# EasyEDA Pro project Servo_Power_Board.epro

# Schematic Schematic1
Board Name: Board1; Create Date: 2026-04-25; Page Name: P1; Project Name: Servo_Board; Schematic Name: Schematic1; Update Date: 2026-05-03; Company: EasyEDA.com; Page Size: A4; Version: V1.0
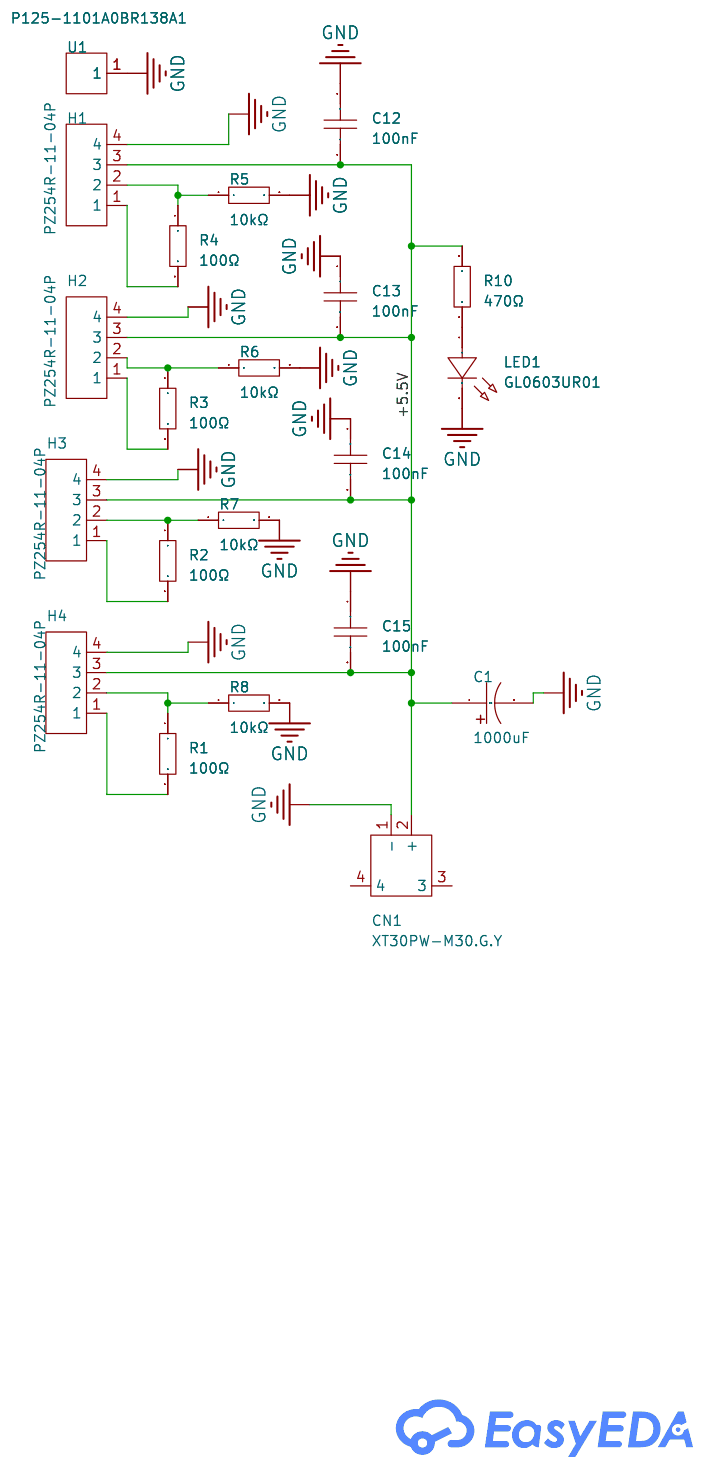
[diagram p0: schematic sheet]

## Parts
C1  1000uF  [CAP-SMD_BD10.0-L10.3-W10.3-LS11.0-R-RD]
C12  100nF  [C0603]
C13  100nF  [C0603]
C14  100nF  [C0603]
C15  100nF  [C0603]
CN1  XT30PW-M30.G.Y  [CONN-TH_XT30PW-M]
H1  PZ254R-11-04P  [HDR-TH_4P-P2.54-H-M-W10.4]
H2  PZ254R-11-04P  [HDR-TH_4P-P2.54-H-M-W10.4]
H3  PZ254R-11-04P  [HDR-TH_4P-P2.54-H-M-W10.4]
H4  PZ254R-11-04P  [HDR-TH_4P-P2.54-H-M-W10.4]
LED1  GL0603UR01  [LED0603-FD]
R1  100Ω  [R0603]
R2  100Ω  [R0603]
R3  100Ω  [R0603]
R4  100Ω  [R0603]
R5  10kΩ  [R0603]
R6  10kΩ  [R0603]
R7  10kΩ  [R0603]
R8  10kΩ  [R0603]
R10  470Ω  [R0603]
U1  P125-1101A0BR138A1  [HDR-TH_1P-P2.54-H-M-W9.7-N]

## Library data of the parts
C1 = VZH102M1ATR-1010: Capacitance:1000uF Tolerance:±20% Tolerance:±20% Voltage Rating:10V Ripple Current:- Equivalent Series Resistance(ESR):- Diameter:10mm Height - Seated (Max):10mm Lifetime:5000hrs@105℃ Operating Temperature:-45℃~+105℃ Operating Temperature:-45℃~+105℃; LCSC Part Name: 1000uF ±20% 10V; Supplier Part: C176684; Manufacturer: Lelon(立隆); Supplier Footprint: SMD,D10xL10mm; JLCPCB Part Class: Extended Part; Datasheet: https://item.szlcsc.com/datasheet/VZH102M1ATR-1010/188074.html; Supplier: LCSC; Tolerance: ±20%; Voltage Rating: 10V; Diameter: 10mm; Height - Seated (Max): 10mm; Lifetime: 5000hrs@105℃; Operating Temperature: -45℃~+105℃
C12-C15 = CAP_0603: Supplier Footprint: 0603
CN1 = XT30PW-M30.G.Y: Rated current:15A Rated voltage: Connector type:Model aircraft plug Wire gauge: contact resistance: Size/Specification: interface form:Male; LCSC Part Name: AMASS(艾迈斯)航模插头电调机插座锂电池连接器 PCB板卧式 公头XT30PW-M30.G.Y; Supplier Part: C431092; Manufacturer: AMASS(艾迈斯); JLCPCB Part Class: Extended Part; Datasheet: https://item.szlcsc.com/datasheet/XT30PW-M30.G.Y/426930.html; Supplier: LCSC; Rated current: 15A; Connector type: Model aircraft plug; interface form: Male
H1-H4 = PZ254R-11-04P: Pin Structure:1x4P Pitch:2.54mm Row Spacing:- Circluar Pins/Square Pins:Pin Header Mounting Type:Right Angle Number of Rows:1 Number of Pins:4P Current Rating:3A Voltage Rating (Max):250V Length of Mating Pin:6mm Insulation Height:2.5mm Length of End Conn; LCSC Part Name: 1x4P 间距:2.54mm 方针 弯插; Supplier Part: C492412; Manufacturer: XFCN(兴飞); Supplier Footprint: 弯插,P=2.54mm; JLCPCB Part Class: Extended Part; Datasheet: https://item.szlcsc.com/datasheet/PZ254R-11-04P/502968.html; Supplier: LCSC; Pin Structure: 1x4P; Pitch: 2.54mm; Circluar Pins/Square Pins: Pin Header; Mounting Type: Right Angle; Number of Rows: 1; Number of Pins: 4P; Current Rating: 3A; Voltage Rating (Max): 250V; Length of Mating Pin: 6mm; Insulation Height: 2.5mm; Contact Material: Brass; Operating Temperature: -40℃~+105℃; Color: Black
LED1 = GL0603UR01: Illumination Color:Red Voltage - Forward(Vf):2.4V Voltage - Forward(Vf):2.4V Forward Current:20mA Wavelength - Dominant:620nm~625nm Wavelength - Dominant:620nm~625nm Diode Configuration:Discrete Diode Lens Color:Water Clear Luminous Intensity:120mcd Lumin; LCSC Part Name: 0603 红灯 高亮; Supplier Part: C51933292; Manufacturer: Guiguang light(桂光光电); Supplier Footprint: 0603; JLCPCB Part Class: Extended Part; Datasheet: https://item.szlcsc.com/datasheet/GL0603UR01/54645988.html; Supplier: LCSC; Illumination Color: Red; Voltage - Forward(Vf): 2.4V; Forward Current: 20mA; Wavelength - Dominant: 620nm~625nm; Diode Configuration: Discrete Diode; Lens Color: Water Clear; Luminous Intensity: 120mcd; Viewing Angle: 120°; Mounting Style: Top-mount; Operating Temperature: -40℃~+85℃
R1-R8 R10 = Res_0603: Supplier Footprint: 0603
U1 = P125-1101A0BR138A1: Pin Structure:1x1P Pitch:2.54mm Row Spacing:2.54mm Circluar Pins/Square Pins:Policy Mounting Type:Right-Angle Number of Rows:Single Row Number of Pins:1P Current Rating:- Voltage Rating (Max):- Length of Mating Pin:6mm Insulation Height:2.5mm Length of En; LCSC Part Name: 1x1P 间距:2.54mm 方针 弯插; Supplier Part: C19190474; Manufacturer: Yxcon(宇熙精密); Supplier Footprint: 弯插,P=2.54mm; JLCPCB Part Class: Extended Part; Datasheet: https://atta.szlcsc.com/upload/public/pdf/source/20231110/B4ABAE5F26C4676492BFDA946B0BE3CA.pdf; Supplier: LCSC; Pin Structure: 1x1P; Pitch: 2.54mm; Row Spacing: 2.54mm; Circluar Pins/Square Pins: Policy; Mounting Type: Right-Angle; Number of Rows: Single Row; Number of Pins: 1P; Length of Mating Pin: 6mm; Insulation Height: 2.5mm; Contact Material: Brass; Contact Plating: Gold; Operating Temperature: -40℃~+105℃; Color: Black

## Nets
+5.5V: C1.1 C12.2 C13.2 C14.2 C15.2 CN1.2(+) H1.3 H2.3 H3.3 H4.3 R10.2
GND: C1.2 C12.1 C13.1 C14.1 C15.1 CN1.1(-) H1.4 H2.4 H3.4 H4.4 LED1.2(C) R5.2 R6.2 R7.2 R8.2 U1.1
$1N327: H3.2 R2.1 R7.1
$1N900: H4.1 R1.2
$1N942: H3.1 R2.2
$1N974: H2.2 R3.1 R6.1
$1N976: H2.1 R3.2
$1N1755: H4.2 R1.1 R8.1
$1N1955: H1.1 R4.2
$1N1961: H1.2 R4.1 R5.1
Net-(LED1-1): LED1.1(A) R10.1

Not connected (* = marked no-connect by the designer): CN1 3 4

# Board PCB1
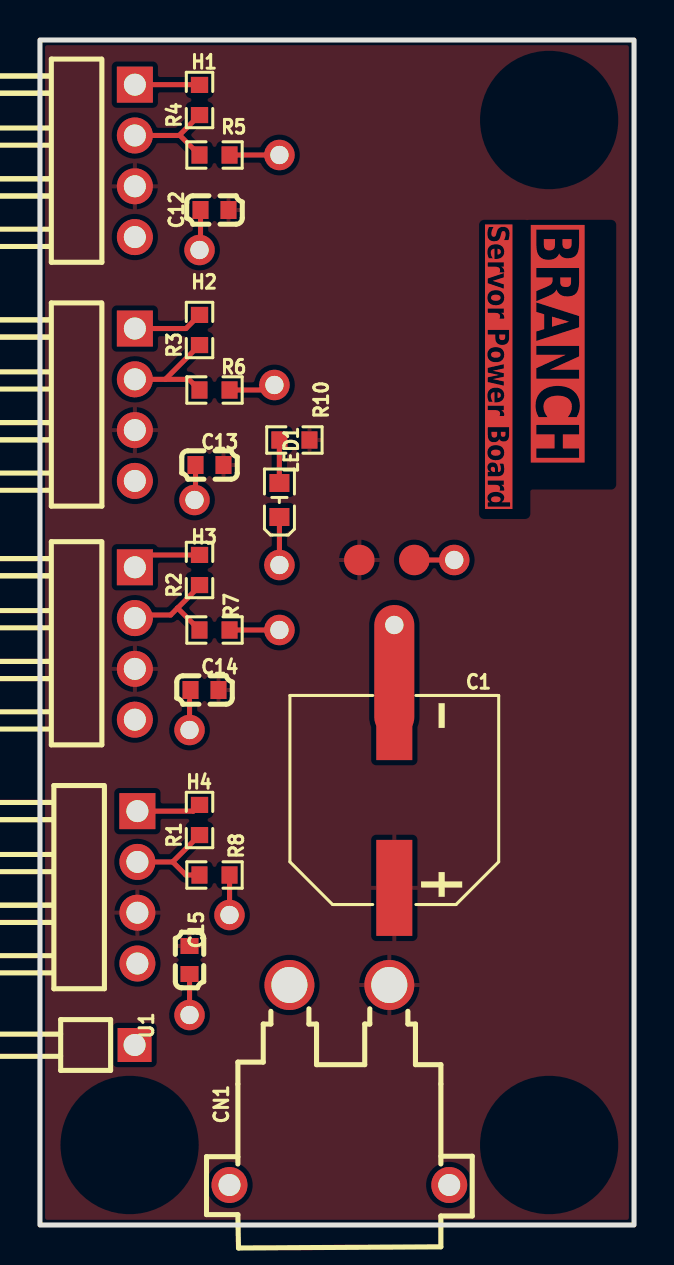
[diagram p1: board, top side]
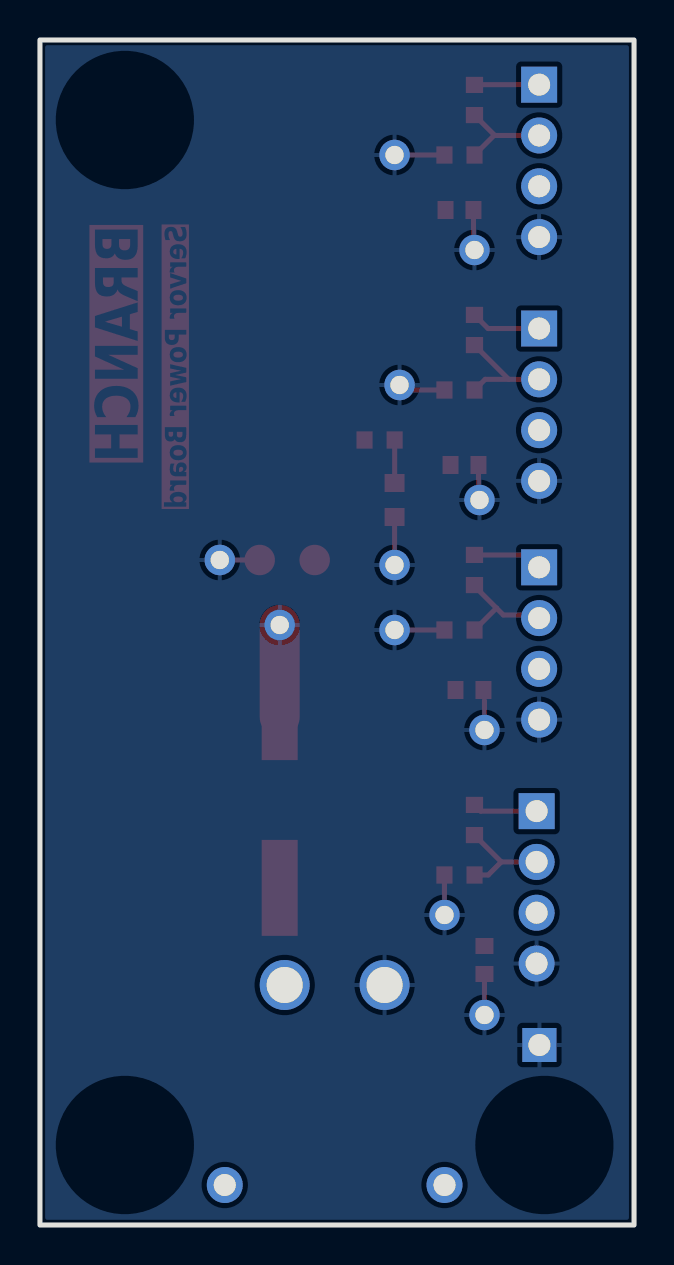
[diagram p2: board, bottom side, seen from below]

Outline 29.74 x 59.25 mm; copper layers: Top Layer, Bottom Layer. Coordinates in mm from the lower left corner of the outline.
Outline path: rectangle 0,59.25 29.74,0
Stack: Top Layer 0.035mm / Dielectric1 1.51mm FR4 er 4.5 / Bottom Layer 0.035mm

## Design rules (mm)
template: Custom Config
spacing copperThickness1oz (default): track to track 0.102, other pairs 0.152 to 0.3
spacing copperThickness2oz: track to track 0.203, other pairs 0.152 to 0.3
track width copperThickness1oz (default): min 0.127, default 0.254, max 5
track width copperThickness2oz: min 0.203, default 0.254, max 2.54
differential pair differentialPair (default): width min 0.127, default 0.254, max 2.54; gap min 0.152, default 0.152
via viaSize (default): diameter min 0.5, default 0.61, max 10; hole min 0.3, default 0.305, max 6.3

## Placement (name value [footprint] x y rotation side)
C1  1000uF  [CAP-SMD_BD10.0-L10.3-W10.3-LS11.0-R-RD]  17.74 21.25 270 top
C12  100nF  [C0603]  8.74 50.75 0 top
C13  100nF  [C0603]  8.49 38 0 top
C14  100nF  [C0603]  8.24 26.75 0 top
C15  100nF  [C0603]  7.49 13.25 90 top
CN1  XT30PW-M30.G.Y  [CONN-TH_XT30PW-M]  14.99 7 0 top
H1  PZ254R-11-04P  [HDR-TH_4P-P2.54-H-M-W10.4]  4.75 53.21 270 top
H2  PZ254R-11-04P  [HDR-TH_4P-P2.54-H-M-W10.4]  4.75 41.01 270 top
H3  PZ254R-11-04P  [HDR-TH_4P-P2.54-H-M-W10.4]  4.75 29.08 270 top
H4  PZ254R-11-04P  [HDR-TH_4P-P2.54-H-M-W10.4]  4.88 16.88 270 top
LED1  GL0603UR01  [LED0603-FD]  11.99 36.25 270 top
NOREF  -  [Pad_e114]  7.99 48.75 0 top
NOREF#2  -  [Pad_e113]  11.99 53.5 0 top
NOREF#3  -  [Pad_e126]  7.49 24.75 0 top
NOREF#4  -  [Pad_e1287]  20.74 33.25 0 top
NOREF#5  -  [Pad_e1284]  18.74 33.25 0 top
NOREF#6  -  [Pad_e466]  11.99 33 0 top
NOREF#7  -  [Pad_e127]  9.49 15.5 0 top
NOREF#8  -  [Pad_e129]  7.49 10.5 0 top
NOREF#9  -  [Pad_e134]  11.74 42 0 top
NOREF#10  -  [Pad_e1285]  15.99 33.25 0 top
NOREF#11  -  [Pad_e141]  17.74 30 0 top
NOREF#12  -  [Pad_e119]  7.74 36.25 0 top
NOREF#13  -  [Pad_e118]  11.99 29.75 0 top
R1  100Ω  [R0603]  7.99 20.25 90 top
R2  100Ω  [R0603]  7.99 32.75 90 top
R3  100Ω  [R0603]  7.99 44.75 90 top
R4  100Ω  [R0603]  7.99 56.25 90 top
R5  10kΩ  [R0603]  8.74 53.5 0 top
R6  10kΩ  [R0603]  8.74 41.75 0 top
R7  10kΩ  [R0603]  8.74 29.75 0 top
R8  10kΩ  [R0603]  8.74 17.5 0 top
R10  470Ω  [R0603]  12.74 39.25 180 top
U1  P125-1101A0BR138A1  [HDR-TH_1P-P2.54-H-M-W9.7-N]  4.74 9 270 top

## Footprints (pads in the part's own frame, mm; a bottom-side part is the same pattern mirrored in y, then rotated)
C0603
  rect 0.8x0.9 smd: 1(-0.7,0) 2(0.7,0)
CAP-SMD_BD10.0-L10.3-W10.3-LS11.0-R-RD
  rect 4.8x1.8 smd: 1(4.395,0) 2(-4.395,0)
CONN-TH_XT30PW-M
  round 2.5 hole 1.8: 1(-2.5,5) 2(2.5,5)
  round 1.8 hole 1.1: 3(5.5,-5) 4(-5.5,-5)
HDR-TH_1P-P2.54-H-M-W9.7-N
  rect 1.7x1.7 hole 1.1: 1(0,0)
HDR-TH_4P-P2.54-H-M-W10.4
  rect 1.8x1.8 hole 1.1: 1(-3.81,0)
  round 1.8 hole 1.1: 2(-1.27,0) 3(1.27,0) 4(3.81,0)
LED0603-FD
  rect 0.9x1 smd: 1(-0.85,0) 2(0.85,0)
Pad_e113
  round 1.524 hole 0.914: 3(0,0)
Pad_e114
  round 1.524 hole 0.914: 4(0,0)
Pad_e118
  round 1.524 hole 0.914: 1(0,0)
Pad_e119
  round 1.524 hole 0.914: 2(0,0)
Pad_e126
  round 1.524 hole 0.914: 1(0,0)
Pad_e127
  round 1.524 hole 0.914: 2(0,0)
Pad_e129
  round 1.524 hole 0.914: 1(0,0)
Pad_e134
  round 1.524 hole 0.914: 1(0,0)
Pad_e141
  round 1.524 hole 0.914: 1(0,0)
Pad_e466
  round 1.524 hole 0.914: 1(0,0)
Pad_e1284
  round 1.524 smd: 1(0,0)
Pad_e1285
  round 1.524 smd: 2(0,0)
Pad_e1287
  round 1.524 hole 0.914: 1(0,0)
R0603
  rect 0.806x0.864 smd: 1(-0.753,0) 2(0.753,0)

## Nets
+5.5V: C1.1 C12.2 C13.2 C14.2 C15.2 CN1.2 H1.3 H2.3 H3.3 H4.3 NOREF#10.2 R10.1
GND: C1.2 C12.1 C13.1 C14.1 C15.1 CN1.1 H1.4 H2.4 H3.4 H4.4 LED1.2 NOREF.4 NOREF#2.3 NOREF#3.1 NOREF#4.1 NOREF#5.1 NOREF#6.1 NOREF#7.2 NOREF#8.1 NOREF#9.1 NOREF#11.1 NOREF#12.2 NOREF#13.1 R5.2 R6.2 R7.2 R8.2 U1.1
$1N327: H3.2 R2.1 R7.1
$1N900: H4.1 R1.2
$1N942: H3.1 R2.2
$1N974: H2.2 R3.1 R6.1
$1N976: H2.1 R3.2
$1N1755: H4.2 R1.1 R8.1
$1N1955: H1.1 R4.2
$1N1961: H1.2 R4.1 R5.1
$1N3174: LED1.1 R10.2

Pads without a net: CN1 3 4

## Routing (per net, layer and track width the routed paths; a pad name or vN(x,y) marks a point on that pad's centre or on a via; arc(x,y) is an arc through that point)
GND: length 25.7
  Top Layer w0.254: NOREF#12.2 7.79,36.3 C13.1 ; NOREF#7.2 9.49,15.5 R8.2 ; C12.1 8.04,48.8 NOREF.4 ; 7.49,26.23 NOREF#3.1 ; R5.2 NOREF#2.3 ; R6.2 11.49,41.75 NOREF#9.1 ; C15.1 NOREF#8.1 ; NOREF#5.1 NOREF#4.1 ; R7.2 NOREF#13.1 ; LED1.2 NOREF#6.1
  Top Layer w2: NOREF#11.1 17.74,25.39
$1N327: length 5.5
  Top Layer w0.254: 6.89,30.85 R7.1 ; 6.89,30.85 6.54,30.5 4.9,30.5 H3.2 ; 6.89,30.85 7.99,31.95 R2.1
$1N900: length 3.2
  Top Layer w0.254: H4.1 7.68,20.69 R1.2
$1N942: length 3.5
  Top Layer w0.254: R2.2 7.98,33.5 5.36,33.5 H3.1
$1N974: length 5.9
  Top Layer w0.254: 6.27,42.28 7.45,42.28 R6.1 ; 6.27,42.28 R3.1 ; 6.27,42.28 H2.2
$1N976: length 3.5
  Top Layer w0.254: H2.1 7.31,44.82 R3.2
$1N1755: length 5.3
  Top Layer w0.254: H4.2 6.64,18.15 ; 6.64,18.15 R1.1 ; 6.64,18.15 7.3,17.5 R8.1
$1N1955: length 3.2
  Top Layer w0.254: R4.2 7.97,57.02 H1.1
$1N1961: length 5.1
  Top Layer w0.254: 6.97,54.48 7.01,54.48 R5.1 ; 6.97,54.48 R4.1 ; 6.97,54.48 H1.2
$1N3174: length 2.2
  Top Layer w0.254: LED1.1 11.98,37.1 R10.2

## Copper pours and planes (outline as drawn; the poured copper is in the pictures)
+5.5V on Top Layer: 0,59.25 29.74,59.25 29.74,0 0,0
GND on Bottom Layer: 0,59.25 29.74,59.25 29.74,0 0,0

## Text on the board
Top Layer: Servor Power Board | BRANCH
